# EAGLE design OLED-1306-I2C (EAGLE 9.6.2)
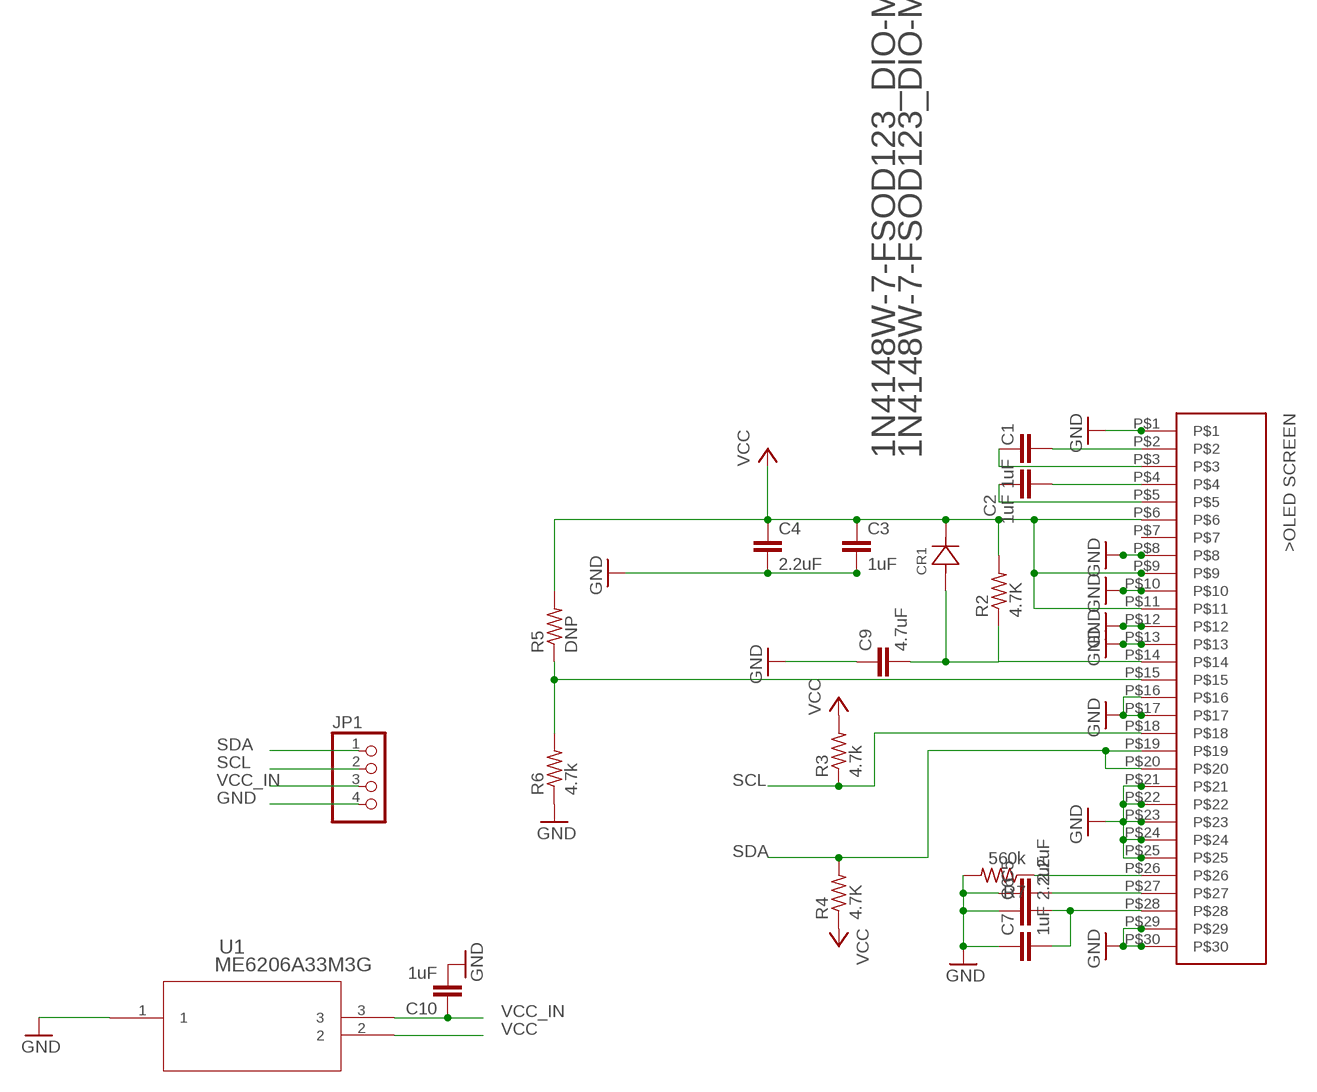
[diagram p0: schematic, sheet 1]

## Parts
C1  1uF  C-EUC0603K  [C0603K]
C2  1uF  C-EUC0603K  [C0603K]
C3  1uF  C-EUC0603K  [C0603K]
C4  2.2uF  C-EUC0603K  [C0603K]
C5  2.2uF  C-EUC0603K  [C0603K]
C6  2.2uF  C-EUC0603K  [C0603K]
C7  1uF  C-EUC0603K  [C0603K]
C9  4.7uF  C-EUC0603K  [C0603K]
C10  1uF  C-EUC0603K  [C0603K]
CR1  1N4148W-7-FSOD123_DIO-M  [SOD123_DIO-M]
JP1  PINHD-1X4  [1X04]
R2  4.7K  R-US_R0603  [R0603]
R3  4.7k  R-US_R0603  [R0603]
R4  4.7K  R-US_R0603  [R0603]
R5  DNP  R-US_R0603  [R0603]
R6  4.7k  R-US_R0603  [R0603]
R7  560k  R-US_R0603  [R0603]
U1  ME6206A33M3G  [IC_ME6206A33M3G_MNM]
U$1  OLED1306-RIBON  [OLED-1306-RIBBON]

## Nets
GND: C3.2 C4.2 C5.1 C6.1 C7.1 C9.1 C10.2 JP1.4 R6.1 R7.2 U1.1 U$1.P$1 U$1.P$8 U$1.P$10 U$1.P$12 U$1.P$13 U$1.P$16 U$1.P$17 U$1.P$21 U$1.P$22 U$1.P$23 U$1.P$24 U$1.P$25 U$1.P$29 U$1.P$30
N$5: C1.1 U$1.P$2
N$6: C2.1 U$1.P$4
N$7: C1.2 U$1.P$3
N$8: C2.2 U$1.P$5
N$9: C9.2 CR1.2 R2.1 U$1.P$14
N$10: R5.1 R6.2 U$1.P$15
N$11: R7.1 U$1.P$26
N$12: C5.2 U$1.P$27
N$13: C6.2 C7.2 U$1.P$28
SCL: JP1.2 R3.1 U$1.P$18
SDA: JP1.1 R4.2 U$1.P$19 U$1.P$20
VCC: C3.1 C4.1 CR1.1 R2.2 R3.2 R4.1 R5.2 U1.2 U$1.P$6 U$1.P$9 U$1.P$11
VCC_IN: C10.1 JP1.3 U1.3
Unconnected: U$1.P$7

## Library data of the parts
C1-C7 C9 C10 = rcl:C-EU: CAPACITOR, European symbol; SPICEPREFIX: C
CR1 = 1N4148W-SOD123:1N4148W-7-F; COPYRIGHT: Copyright (C) 2026 Ultra Librarian. All rights reserved.; DESCRIPTION: DIODE; SWT; SMT (SOD-123); PIV=100V; IF=0.3A; -65 DEGC TO +150 DEGC; MANUFACTURER_NAME: Diodes Inc; MANUFACTURER_PART_NUMBER: 1N4148W-7-F
JP1 = alt_pinhead:PINHD-1X4: PIN HEADER
R2-R7 = rcl:R-US_: RESISTOR, American symbol; SPICEPREFIX: R
U1 = ME6206A33M3G-3v3ldo:ME6206A33M3G; COPYRIGHT: Copyright (C) 2026 Ultra Librarian. All rights reserved.; MANUFACTURER_NAME: MICRONE; MANUFACTURER_PART_NUMBER: ME6206A33M3G
U$1 = OLED-SSD1306:OLED1306-RIBON

## Board
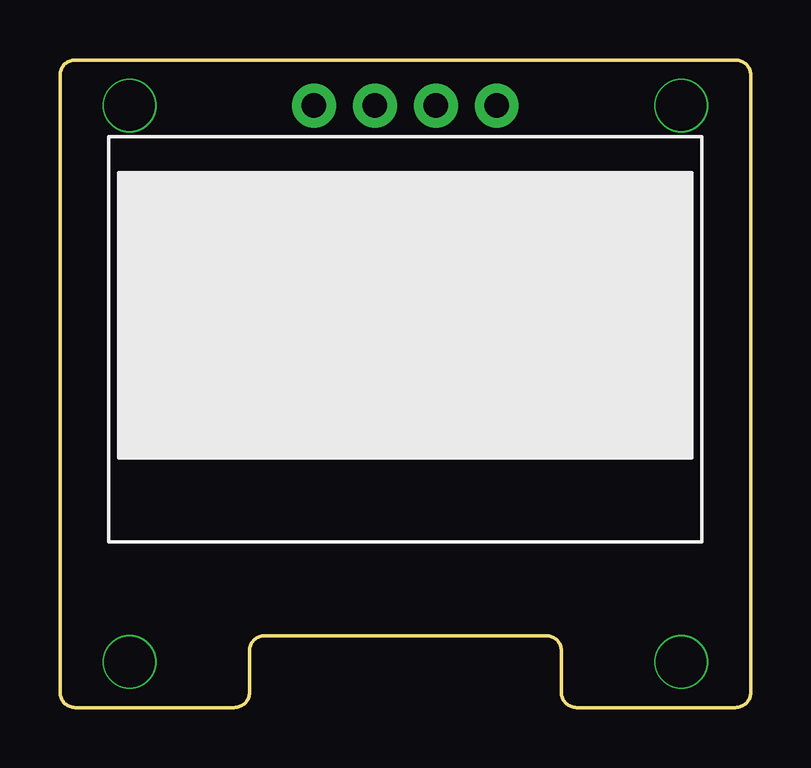
[diagram p1: board, top side]
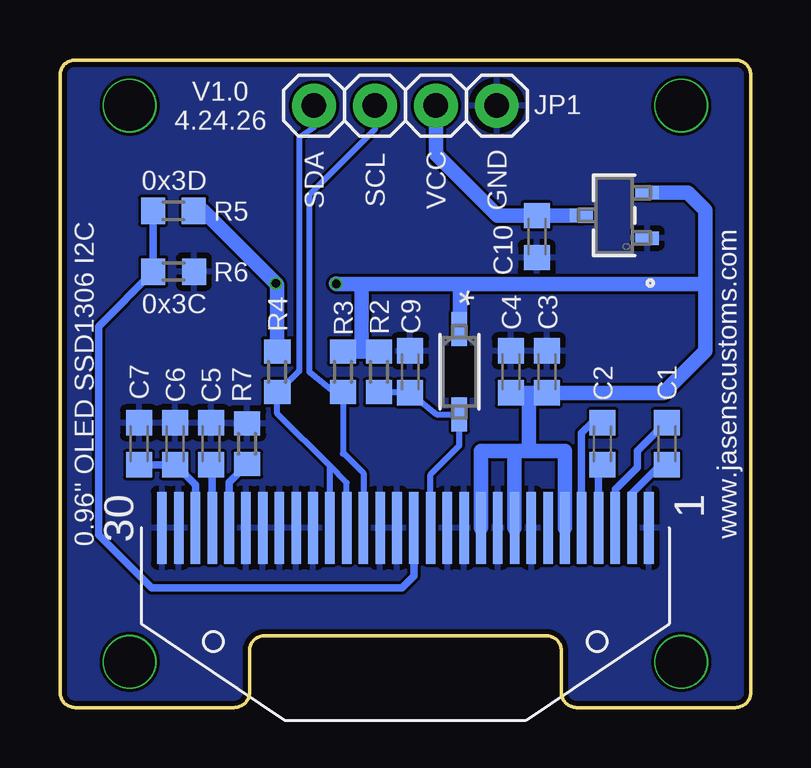
[diagram p2: board, bottom side, seen from below]

Size 28.8 x 27 mm. Coordinates in mm from the lower left corner, seen from the top.
Outline: 28.16,27 0.64,27 arc90 0,26.36 0,0.64 arc90 0.64,0 7.26,0 arc90 7.9,0.64 7.9,2.37 arc-90 8.54,3 20.27,3 arc-90 20.9,2.37 20.9,0.64 arc90 21.54,0 28.16,0 arc90 28.8,0.64 28.8,26.36 arc90 28.16,27
Copper layers (1*16): Top 0.035mm / dielectric 1.6mm / Bottom 0.035mm
Design rules "jlcpcb-2layers": minimum track width 5mil, minimum drill 0.3mm, track to track 5mil, track to pad 5mil, pad to pad 5mil, via to via 5mil, smd to smd 5mil, copper to edge 0.2mm, drill to drill 6mil, minimum pad ring 10mil, minimum via ring 3mil, stop-mask expansion 4mil, vias tented up to drill 0mil, thermal gap 10mil

### Footprints (pad centres in the part's own frame; a part is rotated, then mirrored left to right if it is on the bottom)
C0603K = smd 1.05 x 1.08: 1 -0.875,0; 2 0.875,0
SOD123_DIO-M = smd 1.416 x 0.652: 1 -1.776,0; 2 1.776,0
1X04 = drill 1.016: 1 -3.81,0; 2 -1.27,0; 3 1.27,0; 4 3.81,0
R0603 = smd 1 x 1.1: 1 -0.85,0; 2 0.85,0
IC_ME6206A33M3G_MNM = smd 0.559 x 0.965: 1 -0.95,-1.372; 2 0.95,-1.372; 3 0,1.372
OLED-1306-RIBBON = smd 0.4 x 3: P$1 -10.15,0; P$2 -9.45,0; P$3 -8.75,0; P$4 -8.05,0; P$5 -7.35,0; P$6 -6.65,0; P$7 -5.95,0; P$8 -5.25,0; P$9 -4.55,0; P$10 -3.85,0; P$11 -3.15,0; P$12 -2.45,0; P$13 -1.75,0; P$14 -1.05,0; P$15 -0.35,0; P$16 0.35,0; P$17 1.05,0; P$18 1.75,0; P$19 2.45,0; P$20 3.15,0; P$21 3.85,0; P$22 4.55,0; P$23 5.25,0; P$24 5.95,0; P$25 6.65,0; P$26 7.35,0; P$27 8.05,0; P$28 8.75,0; P$29 9.45,0; P$30 10.15,0

### Placement (x,y rotation side)
C1  3.5,11 90 bottom
C2  6.18,11 90 bottom
C3  8.5,14 90 bottom
C4  10,14 90 bottom
C5  22.5,11 270 bottom
C6  24,11 270 bottom
C7  25.5,11 270 bottom
C9  14.2,14 270 bottom
C10  8.92,19.63 270 bottom
CR1  12.15,14 270 bottom
JP1  14.4,25.1 0 bottom
R2  15.5,14 90 bottom
R3  17,14 90 bottom
R4  19.74,14 270 bottom
R5  24.07,20.71 0 bottom
R6  24.06,18.17 180 bottom
R7  21,11 90 bottom
U1  5.69,20.52 90 bottom
U$1  14.4,7.5 180 bottom

### Tracks (layer width: path | path; a pad name or v marks a point on that pad's centre or on a via)
GND
  pour Bottom: 0.03,-0.06 0.03,26.99 28.68,26.99 28.68,-0.06 0.04,-0.06
N$1  (via drill 2.1)
  other vias: 25.9,25.1
N$2  (via drill 2.1)
  other vias: 2.9,25.1
N$3  (via drill 2.1)
  other vias: 25.9,1.9
N$4  (via drill 2.1)
  other vias: 2.9,1.9
N$5
  Bottom 0.305: C1.1 3.76,10.12 3.78,10.11 4.95,8.93 U$1.P$2
N$6
  Bottom 0.305: U$1.P$4 6.35,9.96 C2.1
N$7
  Bottom 0.305: C1.2 3.56,11.88 4.74,10.7 4.74,10 5.65,9.09 U$1.P$3
N$8
  Bottom 0.305: U$1.P$5 7.05,11.44 6.61,11.88 C2.2
N$9
  Bottom 0.254: U$1.P$14 13.35,9.72 12.15,10.92 CR1.2 13.1,12.22 C9.2 | R2.1 14.01,13.15 13.99,13.16
  Bottom 0.305: 13.99,13.16 C9.2
N$10
  Bottom 0.305: R5.1 R6.2 27.19,15.89 27.19,7.2 24.98,4.99 14.55,4.99 14.05,5.49 U$1.P$15
N$11
  Bottom 0.305: U$1.P$26 21.75,9.38 21,10.12 21,10.18 21,10.17 R7.1
N$12
  Bottom 0.305: U$1.P$27 22.45,10.07 C5.2
N$13
  Bottom 0.305: U$1.P$28 23.15,9.28 C6.2 C7.2
SCL
  Bottom 0.254: JP1.2 15.67,24.11 18.4,21.38 18.4,13.99 17.38,13.15 R3.1 17,10.58 16.93,10.57 16.15,9.79 U$1.P$18
SDA
  Bottom 0.254: U$1.P$20 17.55,10.07 | 17.55,10.07 19.74,12.26 R4.2 19.74,13.11 18.82,14.03 18.82,23.78 18.21,24.19 JP1.1 | U$1.P$19 16.85,9.37 17.55,10.07
VCC  (via drill 0.35)
  Top 0.61: v19.8,17.68 v17.29,17.68 v17.28,17.67
  Bottom 0.61: U1.2 2.63,21.47 1.89,20.73 1.89,17.65 | R3.2 16.22,14.85 | 16.22,14.85 R2.2 | R5.2 22.83,20.71 v19.8,17.68 19.74,17.62 R4.1 | v17.28,17.67 v17.27,17.66 16.22,17.66 | 16.22,14.85 16.22,17.66 | 16.22,17.66 12.16,17.66 | U$1.P$11 11.25,10.69 11.12,10.69 | 9.88,10.69 11.12,10.69 | 9.25,10.69 7.75,10.69 U$1.P$6 | 9.25,10.69 9.88,10.69 | U$1.P$9 9.85,10.66 9.88,10.69 | 9.32,10.81 9.25,10.69 | C4.1 9.43,13.12 | 9.43,13.12 C3.1 3.63,13.12 1.89,14.87 1.89,17.65 | 9.25,10.69 9.25,13.12 9.43,13.12 | CR1.1 12.13,15.8 12.13,17.63 12.16,17.66 | 12.16,17.66 1.9,17.66 1.89,17.65 | 11.12,10.69
VCC_IN
  Bottom 0.61: JP1.3 13.13,23.08 10.55,20.5 C10.1 7.08,20.5 U1.3

### Text on the board
bNames: V1.0 / 4.24.26 | GND | VCC | SCL | SDA | 0x3D | 0x3C | www.jasenscustoms.com | 0.96" OLED SSD1306 I2C